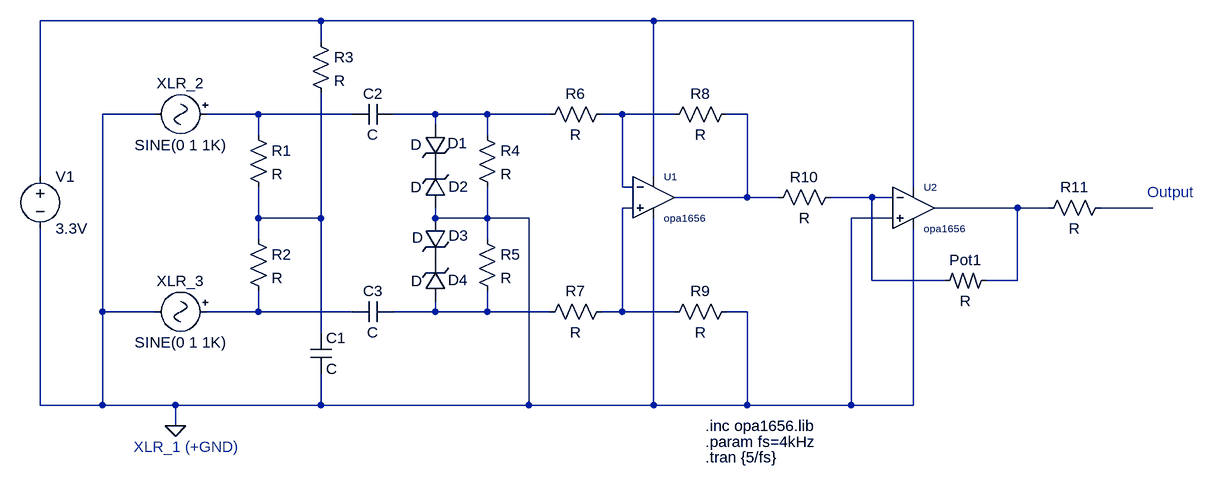
[diagram p0: schematic PreAmp.asc]
PreAmp.asc, the LTspice schematic file:
Version 4.1
SHEET 1 1356 4756
WIRE 0 -2000 -432 -2000
WIRE 512 -2000 0 -2000
WIRE 912 -2000 512 -2000
WIRE 0 -1968 0 -2000
WIRE -256 -1856 -336 -1856
WIRE -96 -1856 -176 -1856
WIRE 48 -1856 -96 -1856
WIRE 176 -1856 112 -1856
WIRE 256 -1856 176 -1856
WIRE 352 -1856 256 -1856
WIRE 464 -1856 432 -1856
WIRE 544 -1856 464 -1856
WIRE 656 -1856 624 -1856
WIRE 176 -1840 176 -1856
WIRE -96 -1824 -96 -1856
WIRE 256 -1824 256 -1856
WIRE -432 -1760 -432 -2000
WIRE 512 -1760 512 -2000
WIRE 464 -1744 464 -1856
WIRE 480 -1744 464 -1744
WIRE 912 -1744 912 -2000
WIRE 656 -1728 656 -1856
WIRE 656 -1728 544 -1728
WIRE 704 -1728 656 -1728
WIRE 848 -1728 784 -1728
WIRE 880 -1728 848 -1728
WIRE 480 -1712 464 -1712
WIRE 1072 -1712 944 -1712
WIRE 1120 -1712 1072 -1712
WIRE 1280 -1712 1200 -1712
WIRE -96 -1696 -96 -1744
WIRE 0 -1696 0 -1888
WIRE 0 -1696 -96 -1696
WIRE 176 -1696 176 -1712
WIRE 256 -1696 256 -1744
WIRE 256 -1696 176 -1696
WIRE 320 -1696 256 -1696
WIRE 880 -1696 816 -1696
WIRE -96 -1664 -96 -1696
WIRE 256 -1664 256 -1696
WIRE 848 -1600 848 -1728
WIRE 960 -1600 848 -1600
WIRE 1072 -1600 1072 -1712
WIRE 1072 -1600 1024 -1600
WIRE -336 -1552 -336 -1856
WIRE -256 -1552 -336 -1552
WIRE -96 -1552 -96 -1584
WIRE -96 -1552 -176 -1552
WIRE 48 -1552 -96 -1552
WIRE 176 -1552 176 -1568
WIRE 176 -1552 112 -1552
WIRE 256 -1552 256 -1584
WIRE 256 -1552 176 -1552
WIRE 352 -1552 256 -1552
WIRE 464 -1552 464 -1712
WIRE 464 -1552 432 -1552
WIRE 544 -1552 464 -1552
WIRE 656 -1552 624 -1552
WIRE 0 -1520 0 -1696
WIRE -432 -1408 -432 -1680
WIRE -336 -1408 -336 -1552
WIRE -336 -1408 -432 -1408
WIRE -224 -1408 -336 -1408
WIRE 0 -1408 0 -1456
WIRE 0 -1408 -224 -1408
WIRE 320 -1408 320 -1696
WIRE 320 -1408 0 -1408
WIRE 512 -1408 512 -1696
WIRE 512 -1408 320 -1408
WIRE 656 -1408 656 -1552
WIRE 656 -1408 512 -1408
WIRE 816 -1408 816 -1696
WIRE 816 -1408 656 -1408
WIRE 912 -1408 912 -1680
WIRE 912 -1408 816 -1408
WIRE -224 -1376 -224 -1408
FLAG -224 -1376 0
SYMBOL OpAmps\\opamp2 512 -1792 R0
WINDOW 0 16 32 Left 1
WINDOW 3 16 96 Left 1
SYMATTR InstName U1
SYMATTR Value opa1656
SYMBOL OpAmps\\opamp2 912 -1776 R0
WINDOW 0 16 32 Left 1
WINDOW 3 16 96 Left 1
SYMATTR InstName U2
SYMATTR Value opa1656
SYMBOL Misc\\signal -160 -1856 R90
WINDOW 0 -32 56 VBottom 2
WINDOW 3 32 56 VTop 2
SYMATTR InstName XLR_2
SYMBOL Misc\\signal -160 -1552 R90
WINDOW 0 -32 56 VBottom 2
WINDOW 3 32 56 VTop 2
SYMATTR InstName XLR_3
SYMBOL res -112 -1840 R0
SYMATTR InstName R1
SYMBOL res -112 -1680 R0
SYMATTR InstName R2
SYMBOL voltage -432 -1776 R0
SYMATTR InstName V1
SYMATTR Value 3.3V
SYMBOL cap -16 -1520 R0
SYMATTR InstName C1
SYMBOL res -16 -1984 R0
SYMATTR InstName R3
SYMBOL cap 112 -1568 R90
WINDOW 0 0 32 VBottom 2
WINDOW 3 32 32 VTop 2
SYMATTR InstName C3
SYMBOL cap 112 -1872 R90
WINDOW 0 0 32 VBottom 2
WINDOW 3 32 32 VTop 2
SYMATTR InstName C2
SYMBOL zener 160 -1840 R0
WINDOW 0 35 28 Left 2
WINDOW 3 -22 31 Left 2
SYMATTR InstName D1
SYMBOL zener 192 -1712 R180
WINDOW 0 -35 33 Left 2
WINDOW 3 37 32 Left 2
SYMATTR InstName D2
SYMBOL zener 160 -1696 R0
WINDOW 0 36 27 Left 2
WINDOW 3 -20 30 Left 2
SYMATTR InstName D3
SYMBOL zener 192 -1568 R180
WINDOW 0 -34 33 Left 2
WINDOW 3 36 31 Left 2
SYMATTR InstName D4
SYMBOL res 240 -1680 R0
SYMATTR InstName R5
SYMBOL res 240 -1840 R0
SYMATTR InstName R4
SYMBOL res 448 -1872 R90
WINDOW 0 0 56 VBottom 2
WINDOW 3 32 56 VTop 2
SYMATTR InstName R6
SYMBOL res 448 -1568 R90
WINDOW 0 0 56 VBottom 2
WINDOW 3 32 56 VTop 2
SYMATTR InstName R7
SYMBOL res 640 -1872 R90
WINDOW 0 0 56 VBottom 2
WINDOW 3 32 56 VTop 2
SYMATTR InstName R8
SYMBOL res 640 -1568 R90
WINDOW 0 0 56 VBottom 2
WINDOW 3 32 56 VTop 2
SYMATTR InstName R9
SYMBOL res 800 -1744 R90
WINDOW 0 0 56 VBottom 2
WINDOW 3 32 56 VTop 2
SYMATTR InstName R10
SYMBOL res2 1024 -1616 R90
WINDOW 0 0 32 VBottom 2
WINDOW 3 32 32 VTop 2
SYMATTR InstName Pot1
SYMBOL res 1216 -1728 R90
WINDOW 0 0 56 VBottom 2
WINDOW 3 32 56 VTop 2
SYMATTR InstName R11
TEXT 592 -1328 Left 2 !.tran {5/fs}
TEXT 592 -1376 Left 2 !.inc opa1656.lib
TEXT 592 -1352 Left 2 !.param fs=4kHz
TEXT -288 -1344 Left 2 ;XLR_1 (+GND)
TEXT 1272 -1736 Left 2 ;Output

The netlist it stands for:
* PreAmp.asc
X§U1 N007 N004 N001 0 N005 opa1656  ; pins In+ In- V+ V- OUT
X§U2 0 N006 N001 0 N008 opa1656  ; pins In+ In- V+ V- OUT
V§XLR_2 N002 0 SINE(0 1 1K)
V§XLR_3 N011 0 SINE(0 1 1K)
R1 N002 N010 R
R2 N010 N011 R
V1 N001 0 3.3V
C1 N010 0 C
R3 N001 N010 R
C3 N012 N011 C
C2 N003 N002 C
D1 N003 P001 D
D2 0 P001 D
D3 0 P002 D
D4 N012 P002 D
R5 0 N012 R
R4 N003 0 R
R6 N004 N003 R
R7 N007 N012 R
R8 N005 N004 R
R9 0 N007 R
R10 N006 N005 R
R§Pot1 N008 N006 R
R11 N009 N008 R
.model D D
.lib standard.dio
.tran {5/fs}
.inc opa1656.lib
.param fs=4kHz
* XLR_1 (+GND)
* Output
.backanno
.end